# Altium schematic sheet Peripherals.SchDoc: Peripherals
size 431 x 279 mm; DrawnBy: DD; DocumentNumber: GHL-1-21002; Revision: C; SheetNumber: 6; SheetTotal: 7; ProjectID: 263-03
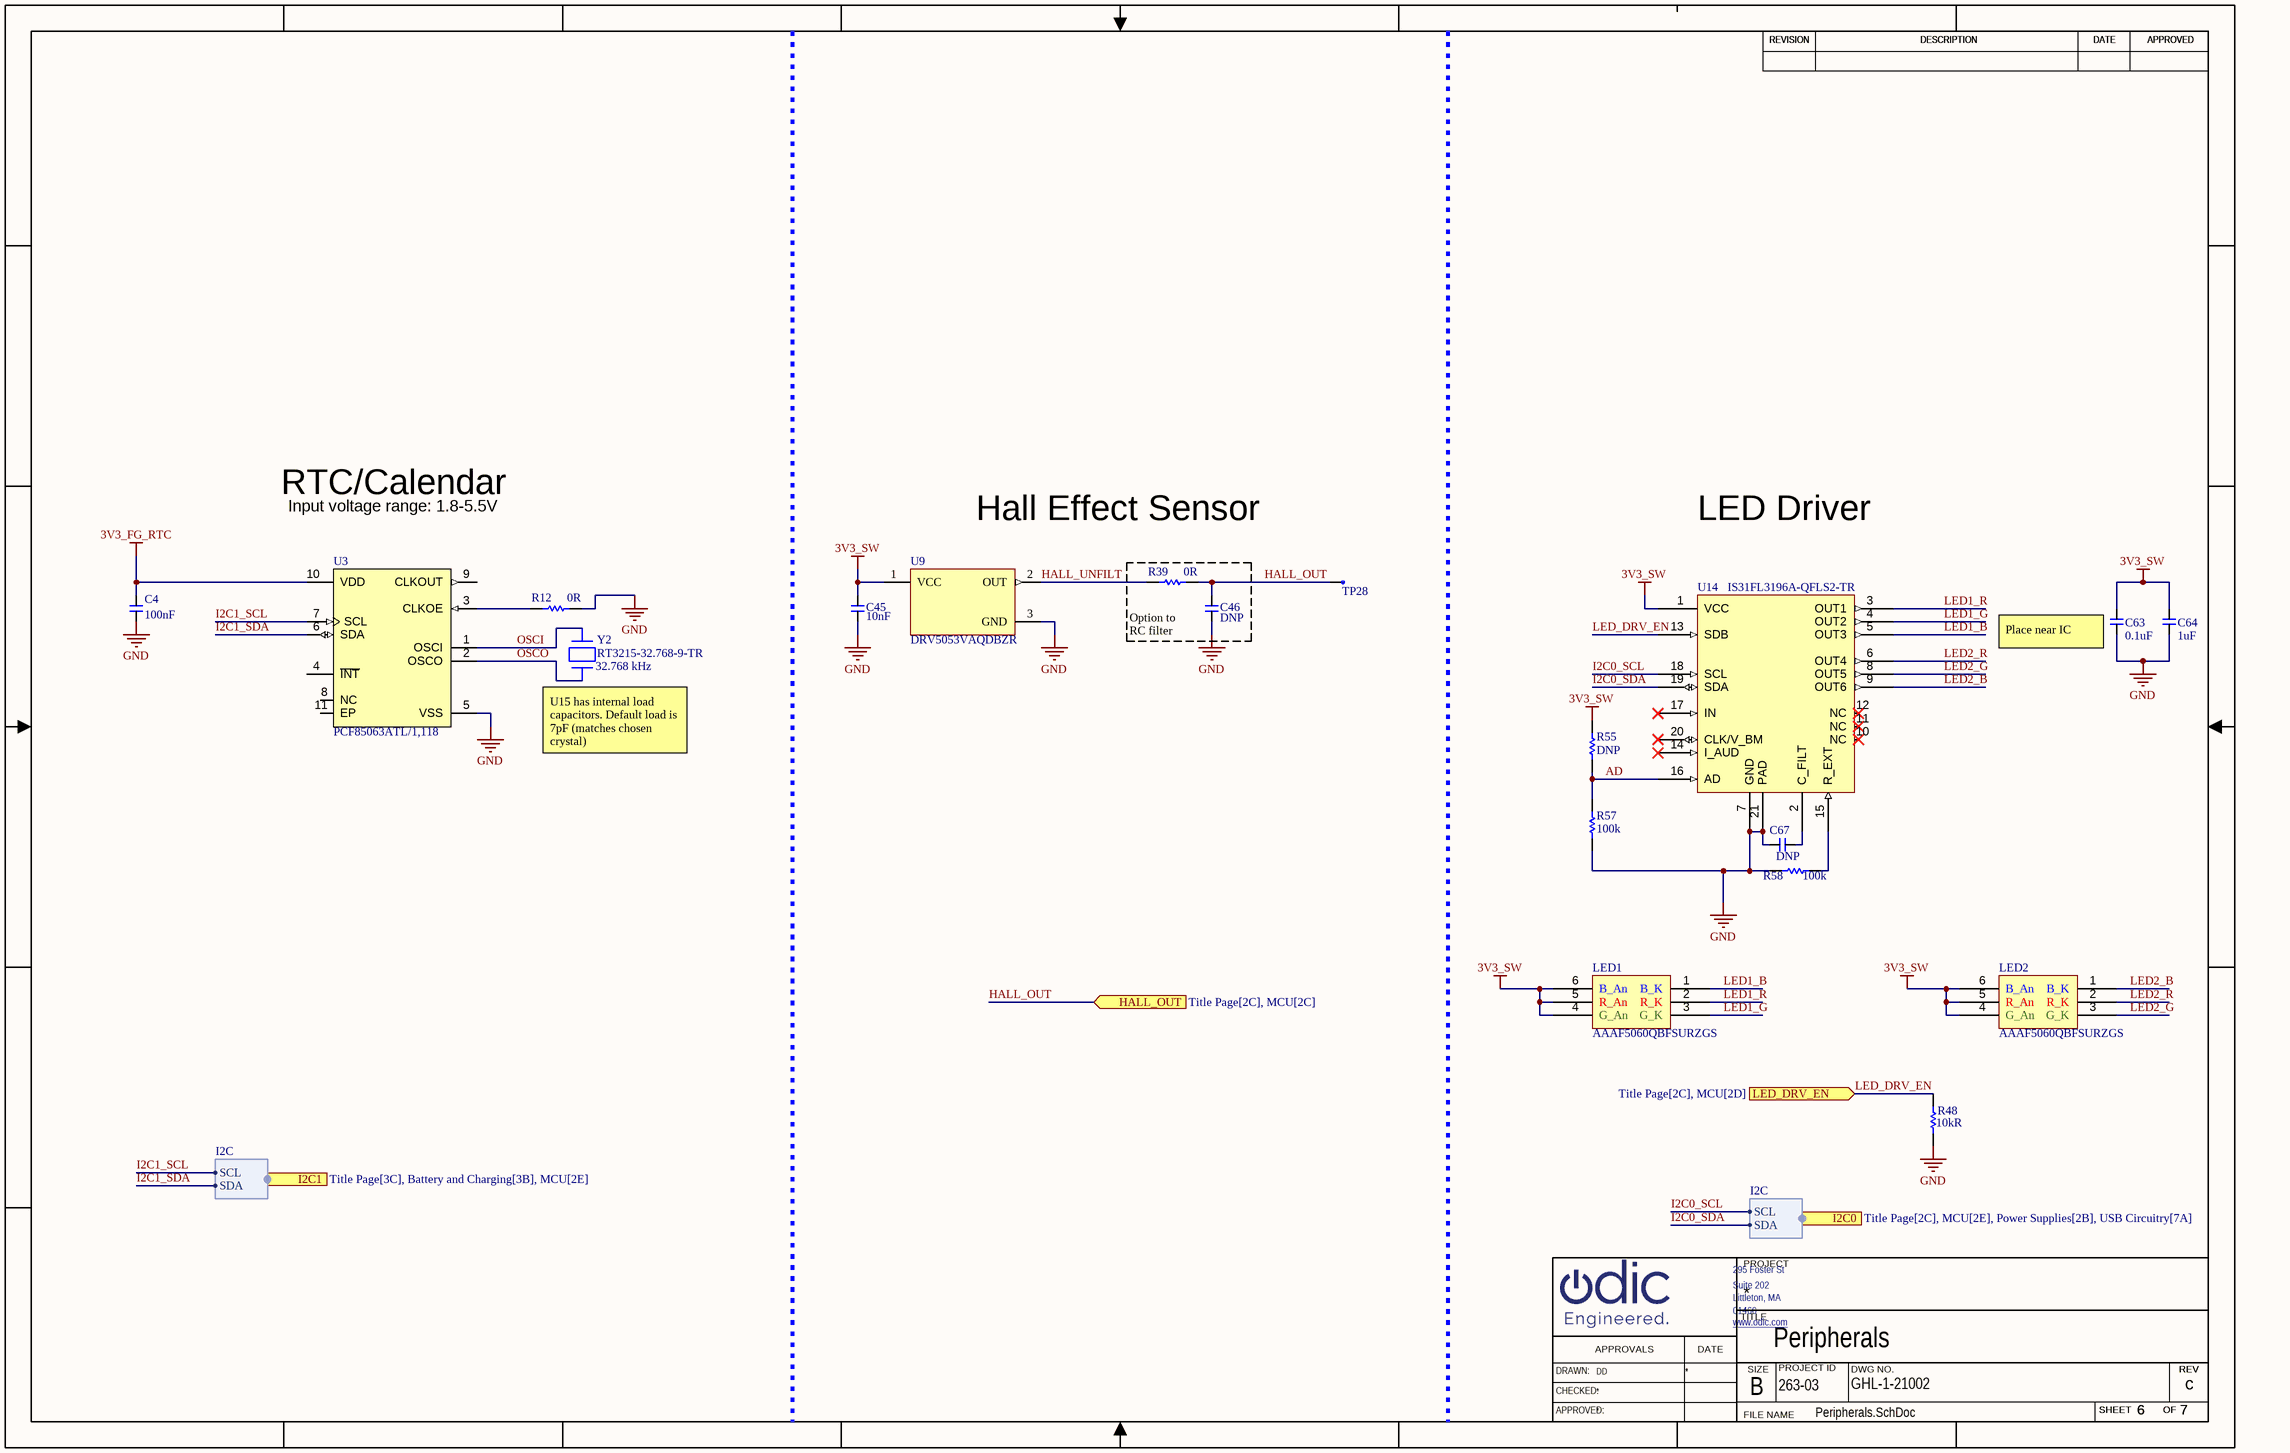
[diagram p0: Peripherals.SchDoc]

## Parts
C4  Capacitance: 100nF  [C0402]  (hidden comment: C0402_100n_16V_10pct)
C45  Capacitance: 10nF  [C0402]  (hidden comment: C0402_10n_6V3_10pct)
C46  Install: DNP  [C0402]  (hidden comment: C0402 Footprint)
C63  0.1uF  [C0402]
C64  1uF  [C0402]
C67  Install: DNP  [C0603]  (hidden comment: N/A)
LED1  AAAF5060QBFSURZGS  [led6_smt_5x6mm]
LED2  AAAF5060QBFSURZGS  [led6_smt_5x6mm]
R12  Resistance: 0R  [R0402]  (hidden comment: R0402_0R)
R39  Resistance: 0R  [R0402]  (hidden comment: R0402_0R)
R48  Resistance: 10kR  [R0402]  (hidden comment: R0402_10k_1pct)
R55  DNP  [R0402]
R57  100k  [R0402]
R58  100k  [R0402]
TP28  TPC30  [tpc30]  (value not drawn)
U3  PCF85063ATL/1,118  [dfn10_2p6x2p6_p5mm]
U9  DRV5053VAQDBZR  [SOT23]
U14  IS31FL3196A-QFLS2-TR  [qfn20_3x3_p4mm]
Y2  RT3215-32.768-9-TR  Operating Frequency: 32.768 kHz  [xtal2_3p2x1p5]

## Ports
HALL_OUT (in, see Title Page[2C], MCU[2C]), I2C0 (harness I2C, see Title Page[2C], MCU[2E], Power Supplies[2B], USB Circuitry[7A]), I2C1 (harness I2C, see Title Page[3C], Battery and Charging[3B], MCU[2E]), LED_DRV_EN (in, see Title Page[2C], MCU[2D])

## Harnesses
I2C: SCL, SDA

## Nets
3V3_FG_RTC: C4.1 U3.10(VDD)
3V3_SW: C45.2 C63.2 C64.2 LED1.4(G_An) LED1.5(R_An) LED1.6(B_An) LED2.4(G_An) LED2.5(R_An) LED2.6(B_An) R55.2 U9.1(VCC) U14.1(VCC)
GND: C4.2 C45.1 C46.1 C63.1 C64.1 C67.2 R12.2 R48.2 R57.1 R58.2 U3.5(VSS) U9.3(GND) U14.7(GND) U14.21(PAD)
AD: R55.1 R57.2 U14.16(AD)
HALL_OUT: C46.2 R39.2 TP28.1 ; port HALL_OUT
HALL_UNFILT: R39.1 U9.2(OUT)
I2C0_SCL: U14.18(SCL) ; port I2C0.SCL
I2C0_SDA: U14.19(SDA) ; port I2C0.SDA
I2C1_SCL: U3.7(SCL) ; port I2C1.SCL
I2C1_SDA: U3.6(SDA) ; port I2C1.SDA
LED1_B: LED1.1(B_K) U14.5(OUT3)
LED1_G: LED1.3(G_K) U14.4(OUT2)
LED1_R: LED1.2(R_K) U14.3(OUT1)
LED2_B: LED2.1(B_K) U14.9(OUT6)
LED2_G: LED2.3(G_K) U14.8(OUT5)
LED2_R: LED2.2(R_K) U14.6(OUT4)
LED_DRV_EN: R48.1 U14.13(SDB) ; port LED_DRV_EN
OSCI: U3.1(OSCI) Y2.1
OSCO: U3.2(OSCO) Y2.2
NetC67_1: C67.1 U14.2(C_FILT)
NetR12_1: R12.1 U3.3(CLKOE)
NetR58_1: R58.1 U14.15(R_EXT)

Not connected (* = marked no-connect by the designer): U3 4(~{INT}) 8(NC) 9(CLKOUT) 11(EP); U14 10(NC)* 11(NC)* 12(NC)* 14(I_AUD)* 17(IN)* 20(CLK/V_BM)*

## Notes on the sheet
- RTC/Calendar
- Input voltage range: 1.8-5.5V
- Hall Effect Sensor
- LED Driver
- Option to RC filter
- (near C63) Place near IC
- (near Y2) U15 has internal load capacitors. Default load is 7pF (matches chosen crystal)
- REVISION
- DESCRIPTION
- DATE
- APPROVED
- 295 Foster St
- PROJECT
- www.odic.com <http://www.odic.com>
- Littleton, MA
- 01460
- Suite 202
- TITLE
- DRAWN:
- CHECKED:
- APPROVALS
- SIZE
- B
- PROJECT ID
- DWG NO.
- SHEET
- OF
- REV
- APPROVED:
- FILE NAME

## Library data of the parts
C4 = CMP-00301-3: 0.1 µF ±10% 16V Ceramic Capacitor X7R 0402 (1005 Metric); Install: POP; Voltage: 16V; Voltage Rating (DC): 16V; Case/Package: 0402; RoHS Compliant: Yes; Dielectric Material: Ceramic; Package Quantity: 1; Dielectric: X7R; Termination: SMD/SMT; Depth: 0.5mm; Radiation Hardening: No; Construction: Flat; Tolerance: 10%; Case Code (Imperial): 0402; Voltage Rating: 16V; Max Operating Temperature: 125°C; Length: 1mm; Lead Free: Lead Free; REACH SVHC: No SVHC; Packaging: Tape and Reel; Mount: Surface Mount,PCB; Series: -; Case Code (Metric): 1005; Min Operating Temperature: -55°C; Width: 0.02inch; Thickness: 0.022inch; Height: 0.56mm; Contact Plating: Tin,Matte
C45 = CMP-00314-2: CAP CER 10000PF 25V 10% X7R 0402; Install: POP; Ratings: AEC-Q200; Lead Free: Lead Free; Series: GCM; Tolerance: 10%; Min Operating Temperature: -55°C; Thickness: 0.022inch; Case Code (Imperial): 0402; Width: 0.02inch; Construction: Flat; Length: 1mm; Radiation Hardening: No; Termination: SMD/SMT; Height: 0.5mm; REACH SVHC: No SVHC; Voltage Rating: 25V; Depth: 0.5mm; RoHS Compliant: Yes; Package Quantity: 1; Mount: Surface Mount; Case Code (Metric): 1005; Dielectric: X7R; Packaging: Tape and Reel; Voltage Rating (DC): 25V; Max Operating Temperature: 125°C; Voltage: 25V; Case/Package: 0402
C46 = CMP-00017-6: Blank pads for future cap placements; Odic Footprint: C0402
C63 = CMP-00369-1: Cap Ceramic 0.1uF 25V X5R 10% Pad SMD 0402 Multi Layer Ceramic Capacitor (MLCC); Capacitance: 100nF; Install: POP; Packaging: Tape and Reel; Construction: Flat; Max Operating Temperature: 85°C; Case Code (Metric): 1005; Voltage Rating (DC): 25V; Min Operating Temperature: -55°C; Height: 0.5mm; Series: CL; Case/Package: 0402; Voltage: 25V; Package Quantity: 1; Radiation Hardening: No; Depth: 0.5mm; Thickness: 0.022inch; Lead Free: Lead Free; Tolerance: 10%; Length: 1mm; Mount: Surface Mount; Width: 0.02inch; Dielectric: X5R; RoHS Compliant: Yes; Voltage Rating: 25V; Case Code (Imperial): 0402
C64 = CMP-00317-1: CAP CER 1UF 16V X5R 0402; Install: POP; Tolerance: 10%; Thickness: 0.022inch; Radiation Hardening: No; Voltage Rating: 16V; Length: 1mm; Voltage: 16V; Capacitance: 1uF; Dielectric: X5R; Packaging: Tape and Reel; Contact Plating: Tin; Min Operating Temperature: -55°C; Series: CL; Depth: 0.5mm; Case Code (Imperial): 0402; Case Code (Metric): 1005; Package Quantity: 1; RoHS Compliant: Yes; Height: 0.5mm; Mount: Surface Mount; Max Operating Temperature: 85°C; Case/Package: 0402; Width: 0.02inch; Construction: Flat
C67 = CMP-00018-1: DNP CAP; Manufacturer: Samsung; Manufacturer Part Number: CL10B104KB8NNWC; Value: .1uF; Tolerance: 10%; Voltage Rating: 50V; Dielectric: X7R; Odic Footprint: C0603; ComponentLink1URL: https://datasheet.ciiva.com/6277/s0717e-6277799.pdf?src-supplier=Digi-Key; ComponentLink1Description: https://datasheet.ciiva.com/6277/s0717e-6277799.pdf?src-supplier=Digi-Key; ComponentLink2URL: https://datasheet.ciiva.com/6277/s0717e-6277800.pdf?src-supplier=Digi-Key; ComponentLink2Description: https://datasheet.ciiva.com/6277/s0717e-6277800.pdf?src-supplier=Digi-Key; ComponentLink3URL: https://datasheet.ciiva.com/6277/s0717e-6277801.pdf?src-supplier=Digi-Key; ComponentLink3Description: https://datasheet.ciiva.com/6277/s0717e-6277801.pdf?src-supplier=Digi-Key; Supplier 1: Digi-Key; Supplier Part Number 1: 1276-1935-1-ND; RoHS: Yes; Category: Ceramic Capacitors; Stock 1: 1643; Pricing 1: 1=0.10000, 10=0.02000, 50=0.01100, 100=0.00910, 500=0.00646, 1000=0.00508 (USD); Mount: Surface Mount; Case/Package: 0603; Case Code (Metric): 1608; Case Code (Imperial): 0603; Contact Plating: Tin; Min Operating Temperature: -55°C; Max Operating Temperature: 125°C; Package Quantity: 1; Packaging: Cut Tape; Termination: Wraparound; Series: CL; Construction: Flat; Length: 0.063inch; Width: 0.031inch; Thickness: 0.035inch; RoHS Compliant: Yes; ComponentLink4URL: https://datasheet.ciiva.com/25740/cl10b104kb8nnwc-25740227.pdf?src-supplier=Digi-Key; ComponentLink4Description: https://datasheet.ciiva.com/25740/cl10b104kb8nnwc-25740227.pdf?src-supplier=Digi-Key
LED1 LED2 = CMP-00100-4: Blue/Red/Green 100º 400/800/1000 mcd Clear Surface Mount LED Lamp; Dominant Wavelength: 465nm; Viewing Angle: 100°; Test Current: 30mA; Forward Voltage: 3.3V; Color: Blue,Green,Red; Luminous Intensity: 400mcd; Install: POP; Forward Current: 20mA; Packaging: Cut Tape; Lens Style: Clear; Package Quantity: 500; Min Operating Temperature: -40°C; RoHS Compliant: Yes; Height: 2.3mm; Case/Package: SMD/SMT; Lens Color: Clear; Width: 6mm; Max Operating Temperature: 85°C; Lead Free: Lead Free; Illumination Color: Blue,Green,Red; Mount: Surface Mount; Length: 5mm
R12 R39 = CMP-00319-1: RES 0 OHM JUMPER 1/16W 0402; Max Power Dissipation: 63mW; Install: POP; Working Voltage: 50V; Current Rating: 1A; Case/Package: 0402; Max Operating Temperature: 155°C; Contact Plating: Tin,Matte; Height: 0.016inch; RoHS Compliant: Yes; Lead Free: Lead Free; Length: 0.039inch; Case Code (Imperial): 0402; Resistor Type: Thick Film; Military Standard: Not; Width: 0.02inch; Construction: Rectangular; Features: Automotive AEC-Q200; Depth: 0.5mm; Case Code (Metric): 1005; Technology: THICK FILM; Number of Terminations: 2; Power Rating: 63mW; Radiation Hardening: No; Min Operating Temperature: -55°C; Series: RMCF; Packaging: Tape and Reel; Mount: Surface Mount
R48 = CMP-00352-1: Res Thick Film 0402 10K Ohm 1% 1/16W ±100ppm/°C Molded SMD SMD T/R; Max Power Dissipation: 63mW; Install: POP; RoHS Compliant: Yes; Number of Terminations: 2; Case/Package: 0402; Case Code (Metric): 1005; Length: 0.039inch; Military Standard: Not; Size Code: 0402; Series: RC; Height: 0.016inch; Contact Plating: Tin; Features: Moisture Resistant; Width: 0.02inch; Mount: Surface Mount; Temperature Coefficient: 100ppm/°C; Package Quantity: 1; Resistor Type: Thick Film; Min Operating Temperature: -55°C; Max Operating Temperature: 155°C; Power Rating: 63mW; Tolerance: 1%; Depth: 0.5mm; Case Code (Imperial): 0402; Construction: Rectangular; Packaging: Tape and Reel; Radiation Hardening: No
R55 = CMP-00015-3: Unpopulated 0402 pads. No part number associated with this "component"; Install: DNP; Odic Footprint: R0402
R57 R58 = CMP-00351-1: Res General Purpose Thick Film 0402 100K Ohm 1% 1/16W ±100ppm/°C Molded SMD Paper T/R; Working Voltage: 50V; Resistance: 100kR; Install: POP; Power Rating: 63mW; Series: RC; Military Standard: Not; Case Code (Metric): 1005; Features: Moisture Resistant; Termination: SMD/SMT; Number of Terminations: 2; Temperature Coefficient: 100ppm/°C; Height: 0.016inch; Tolerance: 1%; Case/Package: 0402; Depth: 0.5mm; RoHS Compliant: Yes; Resistance Tolerance: 1%; Lead Free: Lead Free; Max Operating Temperature: 155°C; Min Operating Temperature: -55°C; Width: 0.02inch; Packaging: Tape and Reel; Technology: THICK FILM; Case Code (Imperial): 0402; Package Quantity: 1; REACH SVHC: No SVHC; Resistor Type: Thick Film; Max Power Dissipation: 63mW; Voltage Rating: 50V; Length: 0.039inch; Construction: Rectangular
TP28 = CMP-00021-4: Test Point Circle 30; Install: DNP
U3 = CMP-00812-4: IC RTC CLK/CALENDAR I2C 10-SON; Time Format: HH:MM:SS; Logic Function: Clock; Min Supply Voltage: 900mV; Date Format: Binary; Max Supply Voltage: 5.5V; Install: POP; Reach SVHC Compliant: No; Package Quantity: 4000; Pins: 10; Radiation Hardening: No; Interface: I2C; Max Operating Temperature: 85°C; Mounting Technology: Surface Mount; Case/Package: DFN EP; Lead Free: Lead Free; Min Operating Temperature: -40°C; Packaging: Tape and Reel; RoHS Compliant: Yes
U9 = CMP-00955-3: SENSOR HALL ANALOG SOT23-3 / Hall Effect Sensor Single Axis SOT-23-3; Output Type: Analog Voltage; Output Current: 2.3mA; Max Supply Voltage: 38V; Min Supply Voltage: 2.5V; Bandwidth: 20kHz; Max Supply Current: 3.6mA; Width: 1.3mm; Height: 1.22mm; RoHS Compliant: Yes; Series: Automotive, AEC-Q100; Max Output current: 2.3mA; Max Operating Temperature: 125°C; Lead Free: Lead Free; Mounting Technology: Surface Mount; Pins: 3; Min Operating Temperature: -40°C; Length: 2.92mm; Case/Package: SOT-23; Radiation Hardening: No; Thickness: 1mm; Sensing Method: Hall Effect; Packaging: Tape and Reel
U14 = CMP-00912-2: 6-Channel Light Effect LED Driver with I2C Interface 2.7V to 5.5V Input 20-Pin QFN T/R; Install: POP; Dimming: I²C; Output Current per Channel: 40mA; Number of Outputs: 6; Max Operating Temperature: 85°C; Case/Package: QFN; Mounting Technology: Surface Mount; Min Operating Temperature: -40°C; Max Supply Voltage: 5.5V; Packaging: Cut Tape; RoHS Compliant: Yes; Series: -
Y2 = CMP-00624-3: RT3215 Series 0.032768 ±20 ppm 9pF -40°C TO +85°C SMT Tuning Fork Crystal; Value: 9E-12F; Frequency Tolerance: 20ppm; Install: POP; RoHS Compliant: Yes; Min Operating Temperature: -40°C; Max Operating Temperature: 85°C; Lead Free: Lead Free; Load Capacitance: 9pF